# EAGLE schematic AT SoM Carrier Board V1.1 (EAGLE 9.6.1)

## Sheet 1 of 4
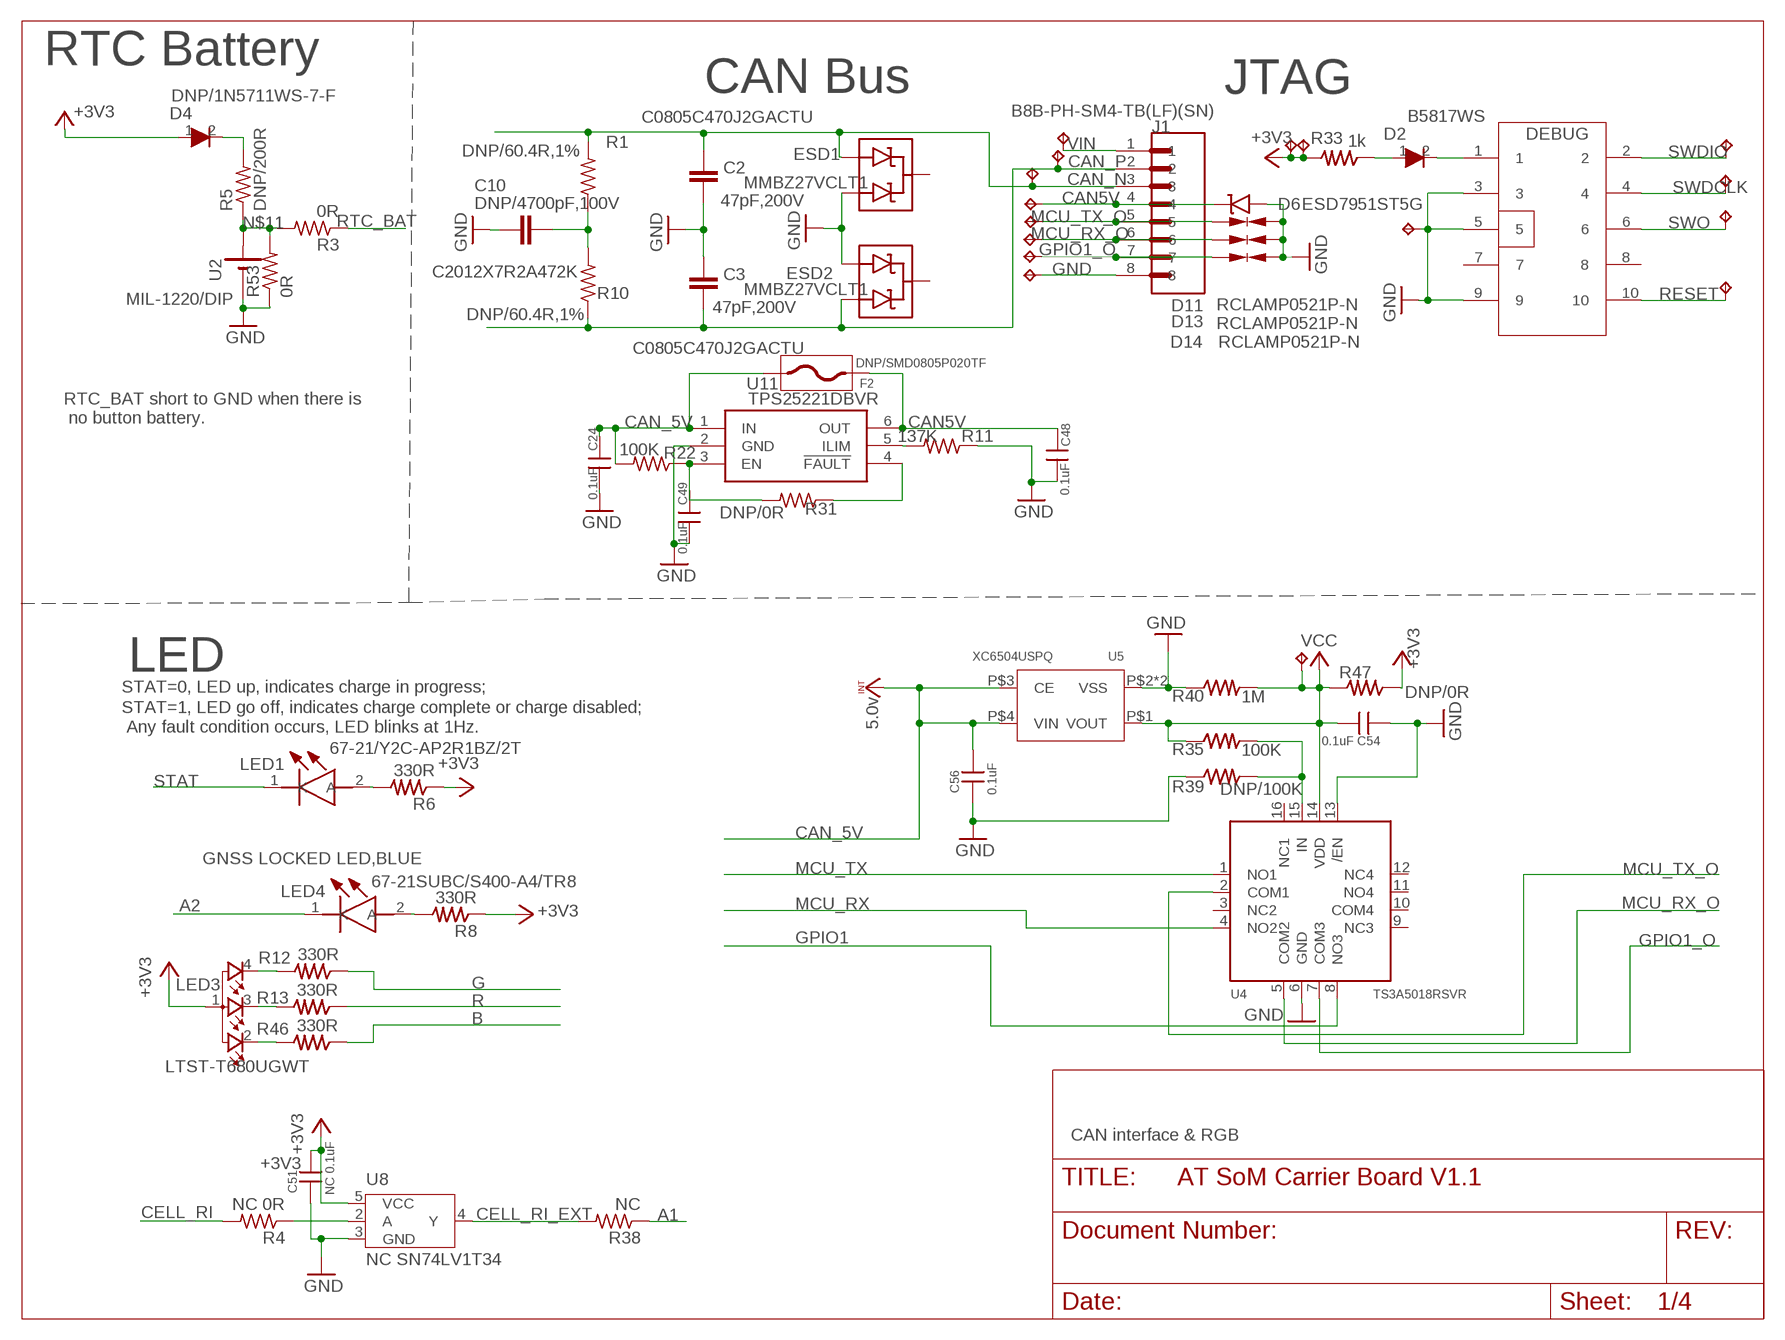
[diagram p0: schematic, sheet 1]

### Parts
C2  47pF,200V  C-EUC0805  [C0805]
C3  47pF,200V  C-EUC0805  [C0805]
C10  DNP/4700pF,100V  C-EUC0805  [C0805]
C24  0.1uF  CAP0402  [C-0402]
C48  0.1uF  CAP0402  [C-0402]
C49  0.1uF  CAP0402  [C-0402]
C51  NC 0.1uF  CAP0402  [C-0402]
C54  0.1uF  CAP0402  [C-0402]
C56  0.1uF  CAP0402  [C-0402]
D2  B5817WS  DIODESOD323  [SOD-323]
D4  DNP/1N5711WS-7-F  DIODESOD323  [SOD-323]
D6  ESD7951ST5G  ESD-TVS-UNIDIR  [0402-TVS-UNIDIR]
D11  RCLAMP0521P-N  ESD  [C0402]
D13  RCLAMP0521P-N  ESD  [C0402]
D14  RCLAMP0521P-N  ESD  [C0402]
DEBUG  CON5X2  [CON5X2_1.27]
ESD1  MMBZ27VCLT1  [SOT23-3]
ESD2  MMBZ27VCLT1  [SOT23-3]
F2  DNP/SMD0805P020TF  FUSE  [F0805]
J1  B8B-PH-SM4-TB(LF)(SN)  [JST_B8B-PH-SM4-TB(LF)(SN)]
LED1  67-21/Y2C-AP2R1BZ/2T  150141GS73113  [LEDM3528X210N]
LED3  LTST-T680UGWT  150141M173100  [150141M173100]
LED4  67-21SUBC/S400-A4/TR8  150141GS73113  [LEDM3528X210N]
R1  DNP/60.4R,1%  R-US_R1206  [R1206]
R3  0R  R-US_  [R0402_B]
R4  NC 0R  R-US_  [R0402_B]
R5  DNP/200R  R-US_  [R0402_B]
R6  330R  RES0402S  [R-0402S]
R8  330R  RES0402S  [R-0402S]
R10  DNP/60.4R,1%  R-US_R1206  [R1206]
R11  137K  R-US_  [R0402_B]
R12  330R  RES0402S  [R-0402S]
R13  330R  RES0402S  [R-0402S]
R22  100K  R-US_  [R0402_B]
R31  DNP/0R  R-US_  [R0402_B]
R33  1k  RES0402S  [R-0402S]
R35  100K  RES0402S  [R-0402S]
R38  NC  R-US_  [R0402_B]
R39  DNP/100K  RES0402S  [R-0402S]
R40  1M  RES0402S  [R-0402S]
R46  330R  RES0402S  [R-0402S]
R47  DNP/0R  RES0402S  [R-0402S]
R53  0R  R-US_  [R0402_B]
TP11  TPTP10R  [TP10R]
TP12  TPTP10R  [TP10R]
TP13  TPTP10R  [TP10R]
TP15  TPTP10R  [TP10R]
TP16  TPTP10R  [TP10R]
TP21  TPTP10R  [TP10R]
TP22  TPTP10R  [TP10R]
TP43  TPTP10R  [TP10R]
TP44  TPTP10R  [TP10R]
TP46  TPTP10R  [TP10R]
TP47  TPTP10R  [TP10R]
TP48  TPTP10R  [TP10R]
TP49  TPTP10R  [TP10R]
TP50  TPTP10R  [TP10R]
TP51  TPTP10R  [TP10R]
TP52  TPTP10R  [TP10R]
U2  MIL-1220/DIP  ML-1220/F1ANBAT_MIL-1220/DIP  [BAT_ML-1220/DIP]
U4  TS3A5018RSVR  [UQFN-16]
U5  XC6504USPQ  [USPQ-4B04]
U8  NC SN74LV1T34  SN74LV1T34  [SC70-5]
U11  TPS25221DBVR  [SOT95P280X145-6N]

### Nets
+3V3 [+3V3]: C51.1 D4.1 LED3.1 R6.1 R8.1 R33.2 R47.1 TP16.TP TP21.TP U8.5(VCC) ; also sheet 2,3
A1: R38.1 ; also sheet 2
A2: LED4.1(K) ; also sheet 2
B: R46.1 ; also sheet 2
CAN5V: C48.1 D6.1 F2.P$1 J1.4 TP48.TP U11.6(OUT)
CAN_5V: C24.1 C56.1 F2.P$2 R22.2 U5.P$3(CE) U5.P$4(VIN) U11.1(IN) ; supply symbol labelled 5.0v ; also sheet 2
CAN_N [USB_top]: C2.1 ESD1.2(A2) J1.3 R1.2 TP47.TP ; also sheet 2
CAN_P [USB_top]: C3.2 ESD2.1(A1) J1.2 R10.1 TP46.TP ; also sheet 2
CELL_RI: R4.2 ; also sheet 2
CELL_RI_EXT: R38.2 U8.4(Y)
G: R12.1 ; also sheet 2
GND: C2.2 C3.1 C10.1 C24.2 C48.2 C49.2 C51.2 C54.2 C56.2 D6.2 D11.2 D13.2 D14.2 DEBUG.3 DEBUG.5 DEBUG.9 ESD1.1(A1) ESD2.2(A2) J1.8 R11.1 R39.1 R40.1 R53.1 TP22.TP TP52.TP U2.1(N) U4.6(GND) U4.13(/EN) U5.P$2(VSS) U5.P$5(VSS) U8.3(GND) U11.2(GND) ; also sheet 2,3,4
GPIO1: U4.8(NO3) ; also sheet 2
GPIO1_O: D14.1 J1.7 TP51.TP U4.7(COM3)
MCU_RX: U4.4(NO2) ; also sheet 2
MCU_RX_O: D13.1 J1.6 TP50.TP U4.5(COM2)
MCU_TX: U4.1(NO1) ; also sheet 2
MCU_TX_O: D11.1 J1.5 TP49.TP U4.2(COM1)
N$1: LED1.2(A) R6.2
N$4: LED4.2(A) R8.2
N$6: R4.1 U8.2(A)
N$7 [3V3]: D2.2 DEBUG.1
N$9: C10.2 R1.1 R10.2
N$10: R11.2 U11.5(ILIM)
N$11: R3.2 R5.1 R53.2 U2.2(P)
N$14: C49.1 R22.1 R31.2 U11.3(EN)
N$20: LED3.4 R12.2
N$22: R31.1 U11.4(!FAULT)
N$29: D4.2 R5.2
N$30: R35.2 R39.2 U4.15(IN)
N$33: LED3.2 R46.2
N$34: LED3.3 R13.2
N$86: D2.1 R33.1
R: R13.1 ; also sheet 2
RESET: DEBUG.10 TP11.TP ; also sheet 2
RTC_BAT: R3.1 ; also sheet 2
STAT: LED1.1(K) ; also sheet 2
SWDCLK: DEBUG.4 TP13.TP ; also sheet 2
SWDIO: DEBUG.2 TP15.TP ; also sheet 2
SWO: DEBUG.6 TP12.TP ; also sheet 2
VCC: C54.1 R35.1 R40.2 R47.2 TP44.TP U4.14(VDD) U5.P$1(VOUT) ; supply symbol labelled +3v3
VIN: J1.1 TP43.TP ; also sheet 4
Unconnected: DEBUG.7 DEBUG.8 ESD1.3(C) ESD2.3(C) U4.3(NC2) U4.9(NC3) U4.10(COM4) U4.11(NO4) U4.12(NC4) U4.16(NC1)

### Notes on the sheet
- RTC Battery
- CAN Bus | JTAG
- RTC_BAT short to GND when there is
   no button battery.
- LED
- STAT=0, LED up, indicates charge in progress;
- STAT=1, LED go off, indicates charge complete or charge disabled;
- Any fault condition occurs, LED blinks at 1Hz.
- GNSS LOCKED LED,BLUE
- CAN interface & RGB

## Sheet 2 of 4
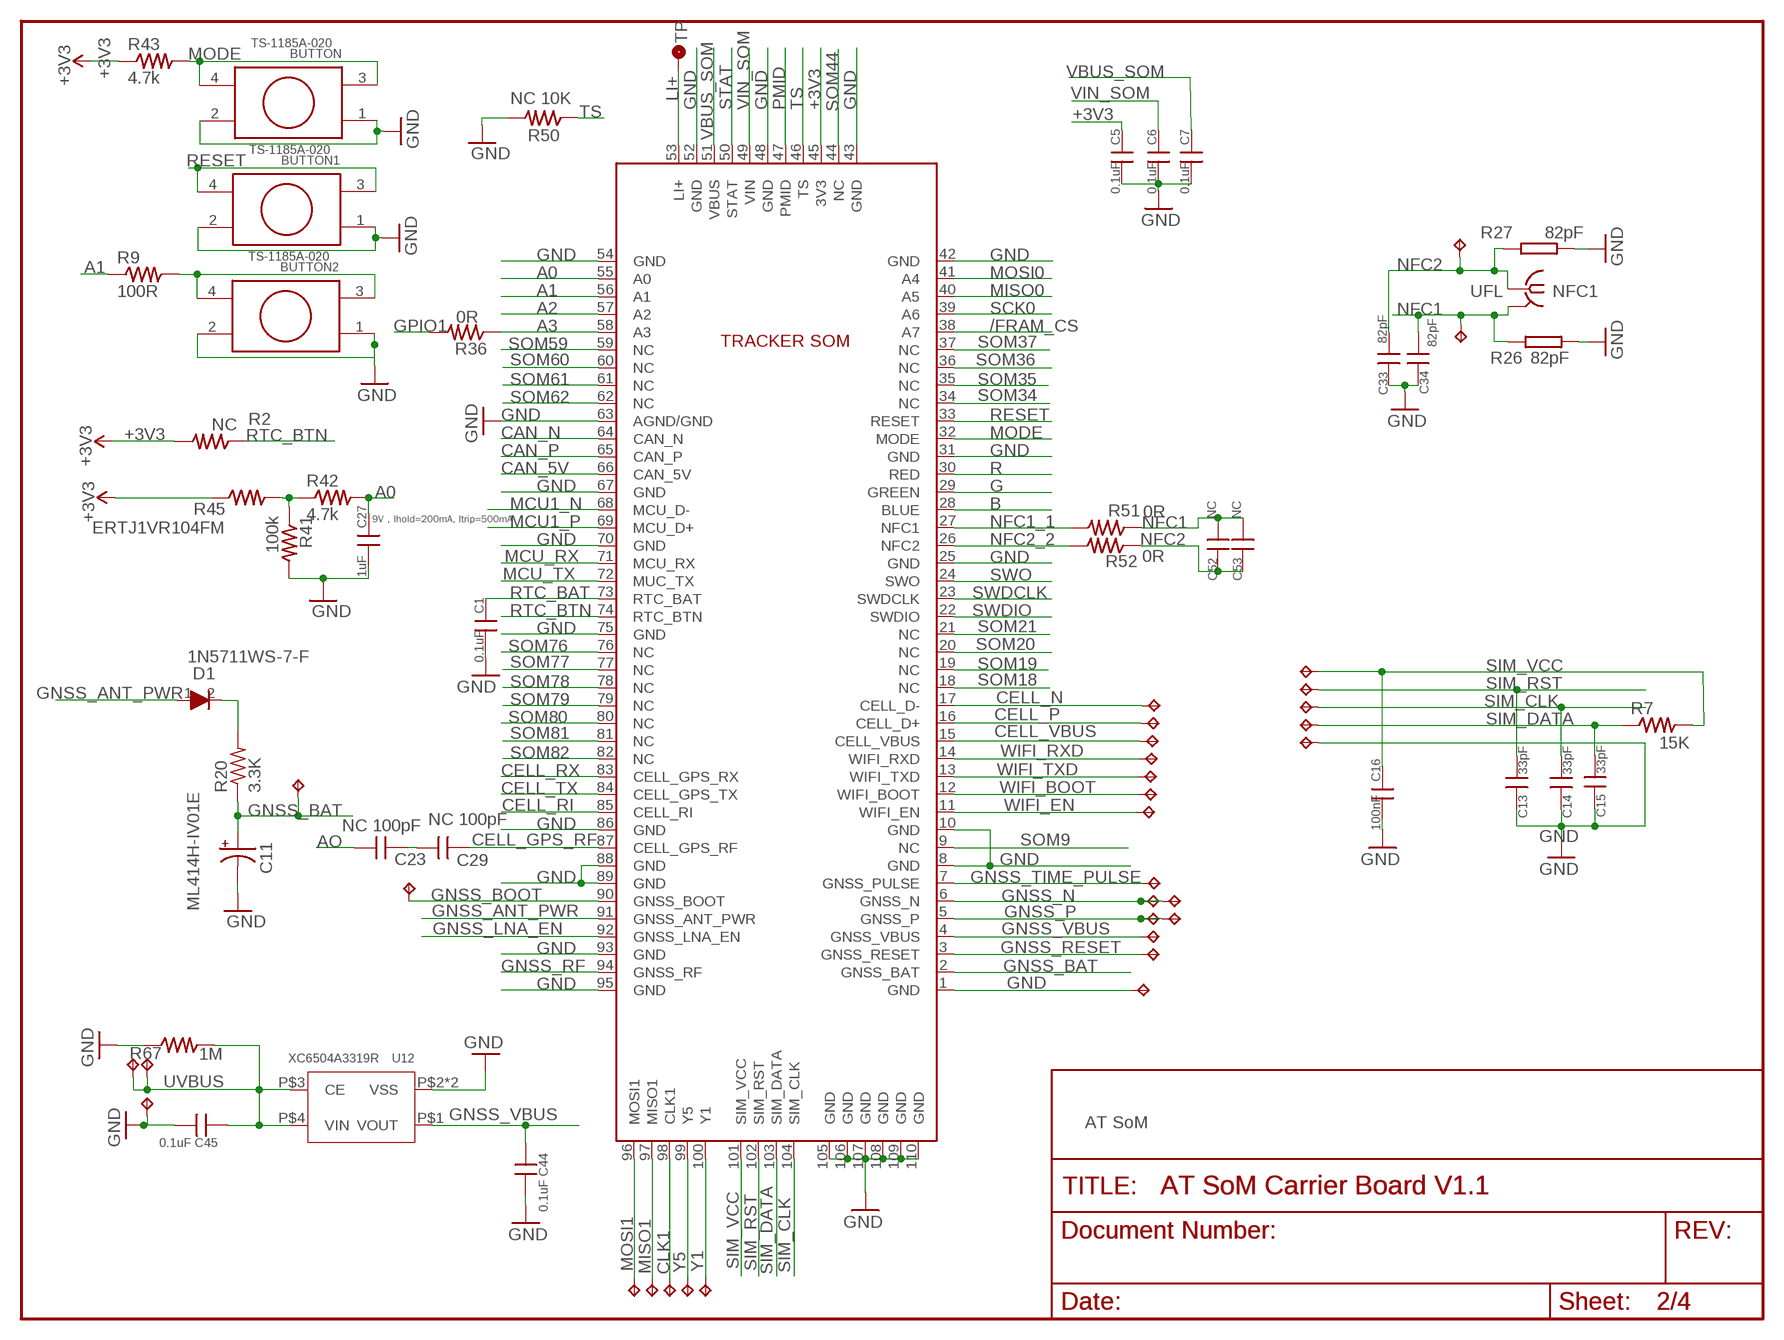
[diagram p1: schematic, sheet 2]

### Parts
BUTTON  TS-1185A-020  [TS-1185A-020]
BUTTON1  TS-1185A-020  [TS-1185A-020]
BUTTON2  TS-1185A-020  [TS-1185A-020]
C1  0.1uF  CAP0402  [C-0402]
C5  0.1uF  CAP0402  [C-0402]
C6  0.1uF  CAP0402  [C-0402]
C7  0.1uF  CAP0402  [C-0402]
C11  ML414H-IV01E  ML414HIV01E  [ML414H]
C13  33pF  CAP0402  [C-0402]
C14  33pF  CAP0402  [C-0402]
C15  33pF  CAP0402  [C-0402]
C16  100nF  CAP0402  [C-0402]
C23  NC 100pF  CAP_0402  [C0402_P]
C27  1uF  CAP0402  [C-0402]
C29  NC 100pF  CAP_0402  [C0402_P]
C33  82pF  CAP0402  [C-0402]
C34  82pF  CAP0402  [C-0402]
C44  0.1uF  CAP0402  [C-0402]
C45  0.1uF  CAP0402  [C-0402]
C52  NC  CAP0402  [C-0402]
C53  NC  CAP0402  [C-0402]
D1  1N5711WS-7-F  DIODESOD323  [SOD-323]
NFC1  UFL  IPEX-20279-001E  [IPEX-20279-001E]
R2  NC  RES0402S  [R-0402S]
R7  15K  RES0402S  [R-0402S]
R9  100R  RES0402S  [R-0402S]
R20  3.3K  RES_0603  [R0603_P]
R26  82pF  RES0402S  [R-0402S]
R27  82pF  RES0402S  [R-0402S]
R36  0R  RES0402S  [R-0402S]
R41  100k  RES0402S  [R-0402S]
R42  4.7k  RES0402S  [R-0402S]
R43  4.7k  RES0402S  [R-0402S]
R45  ERTJ1VR104FM  RESR0603  [R0603]
R50  NC 10K  RES0402S  [R-0402S]
R51  0R  RES0402S  [R-0402S]
R52  0R  RES0402S  [R-0402S]
R67  1M  RES0402S  [R-0402S]
TP1  TPTP10R  [TP10R]
TP2  TPTP10R  [TP10R]
TP3  TPTP10R  [TP10R]
TP4  TPTP10R  [TP10R]
TP5  TPTP10R  [TP10R]
TP6  TPTP10R  [TP10R]
TP7  TPTP10R  [TP10R]
TP8  TPTP10R  [TP10R]
TP9  TPTP10R  [TP10R]
TP14  TPTP10R  [TP10R]
TP17  TPTP10R  [TP10R]
TP18  TPTP10R  [TP10R]
TP19  TPTP10R  [TP10R]
TP20  TPTP10R  [TP10R]
TP27  TPTP10R  [TP10R]
TP28  TPTP10R  [TP10R]
TP29  TPTP10R  [TP10R]
TP30  TPTP10R  [TP10R]
TP31  TPTP10R  [TP10R]
TP32  TPTP10R  [TP10R]
TP33  TPTP10R  [TP10R]
TP34  TPTP10R  [TP10R]
TP35  TPTP10R  [TP10R]
TP36  TPTP10R  [TP10R]
TP37  TPTP10R  [TP10R]
TP38  TPTP10R  [TP10R]
TP39  TPTP10R  [TP10R]
TP40  TPTP10R  [TP10R]
TP41  TPTP10R  [TP10R]
TP42  TPTP10R  [TP10R]
U1  TRACKERSOM_V04  [TRACKERSOM_V04]
U12  XC6504A3319R  XC6504USPQ  [USPQ-4B04]
U$1  TP2  [TP70_BOT]
U$9  TPTP10R  [TP10R]
U$10  TPTP10R  [TP10R]

### Nets
+3V3 [+3V3]: C5.1 R2.2 R43.1 R45.1 U1.45(3V3) ; also sheet 1,3
/FRAM_CS: U1.38(A7) ; also sheet 3
A0: C27.1 R42.2 U1.55(A0)
A1: R9.1 U1.56(A1) ; also sheet 1
A2: U1.57(A2) ; also sheet 1
A3: R36.1 U1.58(A3)
AO: C23.1 ; also sheet 3
B: U1.28(BLUE) ; also sheet 1
CAN_5V: U1.66(CAN_5V) ; also sheet 1
CAN_N [USB_top]: U1.64(CAN_N) ; also sheet 1
CAN_P [USB_top]: U1.65(CAN_P) ; also sheet 1
CELL_GPS_RF: C29.2 U1.87(CELL_GPS_RF)
CELL_N [USB_top]: TP38.TP U1.17(CELL_D-)
CELL_P [USB_top]: TP36.TP U1.16(CELL_D+)
CELL_RI: U1.85(CELL_RI) ; also sheet 1
CELL_RX: U1.83(CELL_GPS_RX)
CELL_TX: U1.84(CELL_GPS_TX)
CELL_VBUS: TP35.TP U1.15(CELL_VBUS)
CLK1: TP40.TP U1.98(CLK1)
G: U1.29(GREEN) ; also sheet 1
GND: BUTTON1.1 BUTTON1.2 BUTTON2.1 BUTTON2.2 BUTTON.1 BUTTON.2 C1.2 C5.2 C6.2 C7.2 C11.- C13.1 C14.1 C15.1 C16.2 C27.2 C33.1 C34.1 C44.1 C45.1 R26.2 R27.1 R41.2 R50.2 R67.1 TP18.TP TP20.TP TP32.TP U1.1(GND) U1.8(GND) U1.10(GND) U1.25(GND) U1.31(GND) U1.42(GND) U1.43(GND) U1.48(GND) U1.52(GND) U1.54(GND) U1.63(AGND/GND) U1.67(GND) U1.70(GND) U1.75(GND) U1.86(GND) U1.88(GND) U1.89(GND) U1.93(GND) U1.95(GND) U1.105(GND) U1.106(GND) U1.107(GND) U1.108(GND) U1.109(GND) U1.110(GND) U12.P$2(VSS) U12.P$5(VSS) ; also sheet 1,3,4
GNSS_ANT_PWR: D1.1 U1.91(GNSS_ANT_PWR) ; also sheet 3
GNSS_BAT: C11.+ R20.1 TP9.TP U1.2(GNSS_BAT)
GNSS_BOOT: TP6.TP U1.90(GNSS_BOOT)
GNSS_LNA_EN: U1.92(GNSS_LNA_EN) ; also sheet 3
GNSS_N [USB_top]: TP14.TP TP34.TP U1.6(GNSS_N) ; also sheet 3
GNSS_P [USB_top]: TP5.TP TP19.TP U1.5(GNSS_P) ; also sheet 3
GNSS_RESET: TP8.TP U1.3(GNSS_RESET)
GNSS_RF: U1.94(GNSS_RF) ; also sheet 3
GNSS_TIME_PULSE: TP7.TP U1.7(GNSS_PULSE)
GNSS_VBUS: C44.2 TP30.TP U1.4(GNSS_VBUS) U12.P$1(VOUT)
GPIO1: R36.2 ; also sheet 1
LI+ [+3V3]: U1.53(LI+) U$1.P$1(TP) ; also sheet 3
MCU1_N: U1.68(MCU_D-) ; also sheet 3
MCU1_P: U1.69(MCU_D+) ; also sheet 3
MCU_RX: U1.71(MCU_RX) ; also sheet 1
MCU_TX: U1.72(MUC_TX) ; also sheet 1
MISO0: U1.40(A5) ; also sheet 3
MISO1: TP39.TP U1.97(MISO1)
MODE: BUTTON.3 BUTTON.4 R43.2 U1.32(MODE)
MOSI0: U1.41(A4) ; also sheet 3
MOSI1: TP37.TP U1.96(MOSI1)
N$2: R41.1 R42.1 R45.2
N$3: D1.2 R20.2
N$19: C23.2 C29.1
N$23: BUTTON2.3 BUTTON2.4 R9.2
NFC1: C34.2 C52.2 C53.2 NFC1.2@1(GND) NFC1.2@2(GND) R26.1 R51.1 U$10.TP
NFC1_1: R51.2 U1.27(NFC1)
NFC2: C33.2 C52.1 C53.1 NFC1.1 R27.2 R52.1 U$9.TP
NFC2_2: R52.2 U1.26(NFC2)
PMID: U1.47(PMID)
R: U1.30(RED) ; also sheet 1
RESET: BUTTON1.3 BUTTON1.4 U1.33(RESET) ; also sheet 1
RTC_BAT: C1.1 U1.73(RTC_BAT) ; also sheet 1
RTC_BTN: R2.1 U1.74(RTC_BTN)
SCK0: U1.39(A6) ; also sheet 3
SIM_CLK: C14.2 TP29.TP U1.104(SIM_CLK)
SIM_DATA: C15.2 R7.1 TP31.TP U1.103(SIM_DATA)
SIM_RST: C13.2 TP28.TP U1.102(SIM_RST)
SIM_VCC: C16.1 R7.2 TP27.TP U1.101(SIM_VCC)
SOM9: U1.9(NC)
SOM18: U1.18(NC)
SOM19: U1.19(NC)
SOM20: U1.20(NC)
SOM21: U1.21(NC)
SOM34: U1.34(NC)
SOM35: U1.35(NC)
SOM36: U1.36(NC)
SOM37: U1.37(NC)
SOM44: U1.44(NC)
SOM59: U1.59(NC)
SOM60: U1.60(NC)
SOM61: U1.61(NC)
SOM62: U1.62(NC)
SOM76: U1.76(NC)
SOM77: U1.77(NC)
SOM78: U1.78(NC)
SOM79: U1.79(NC)
SOM80: U1.80(NC)
SOM81: U1.81(NC)
SOM82: U1.82(NC)
STAT: U1.50(STAT) ; also sheet 1
SWDCLK: U1.23(SWDCLK) ; also sheet 1
SWDIO: U1.22(SWDIO) ; also sheet 1
SWO: U1.24(SWO) ; also sheet 1
TS: R50.1 U1.46(TS)
UVBUS: C45.2 R67.2 TP17.TP TP33.TP U12.P$3(CE) U12.P$4(VIN) ; also sheet 3
VBUS_SOM: C7.1 U1.51(VBUS) ; also sheet 3
VIN_SOM: C6.1 U1.49(VIN) ; also sheet 4
WIFI_BOOT: TP3.TP U1.12(WIFI_BOOT)
WIFI_EN: TP4.TP U1.11(WIFI_EN)
WIFI_RXD: TP1.TP U1.14(WIFI_RXD)
WIFI_TXD: TP2.TP U1.13(WIFI_TXD)
Y1: TP42.TP U1.100(Y1)
Y5: TP41.TP U1.99(Y5)

### Notes on the sheet
- 9V，Ihold=200mA, Itrip=500mA
- AT SoM

## Sheet 3 of 4
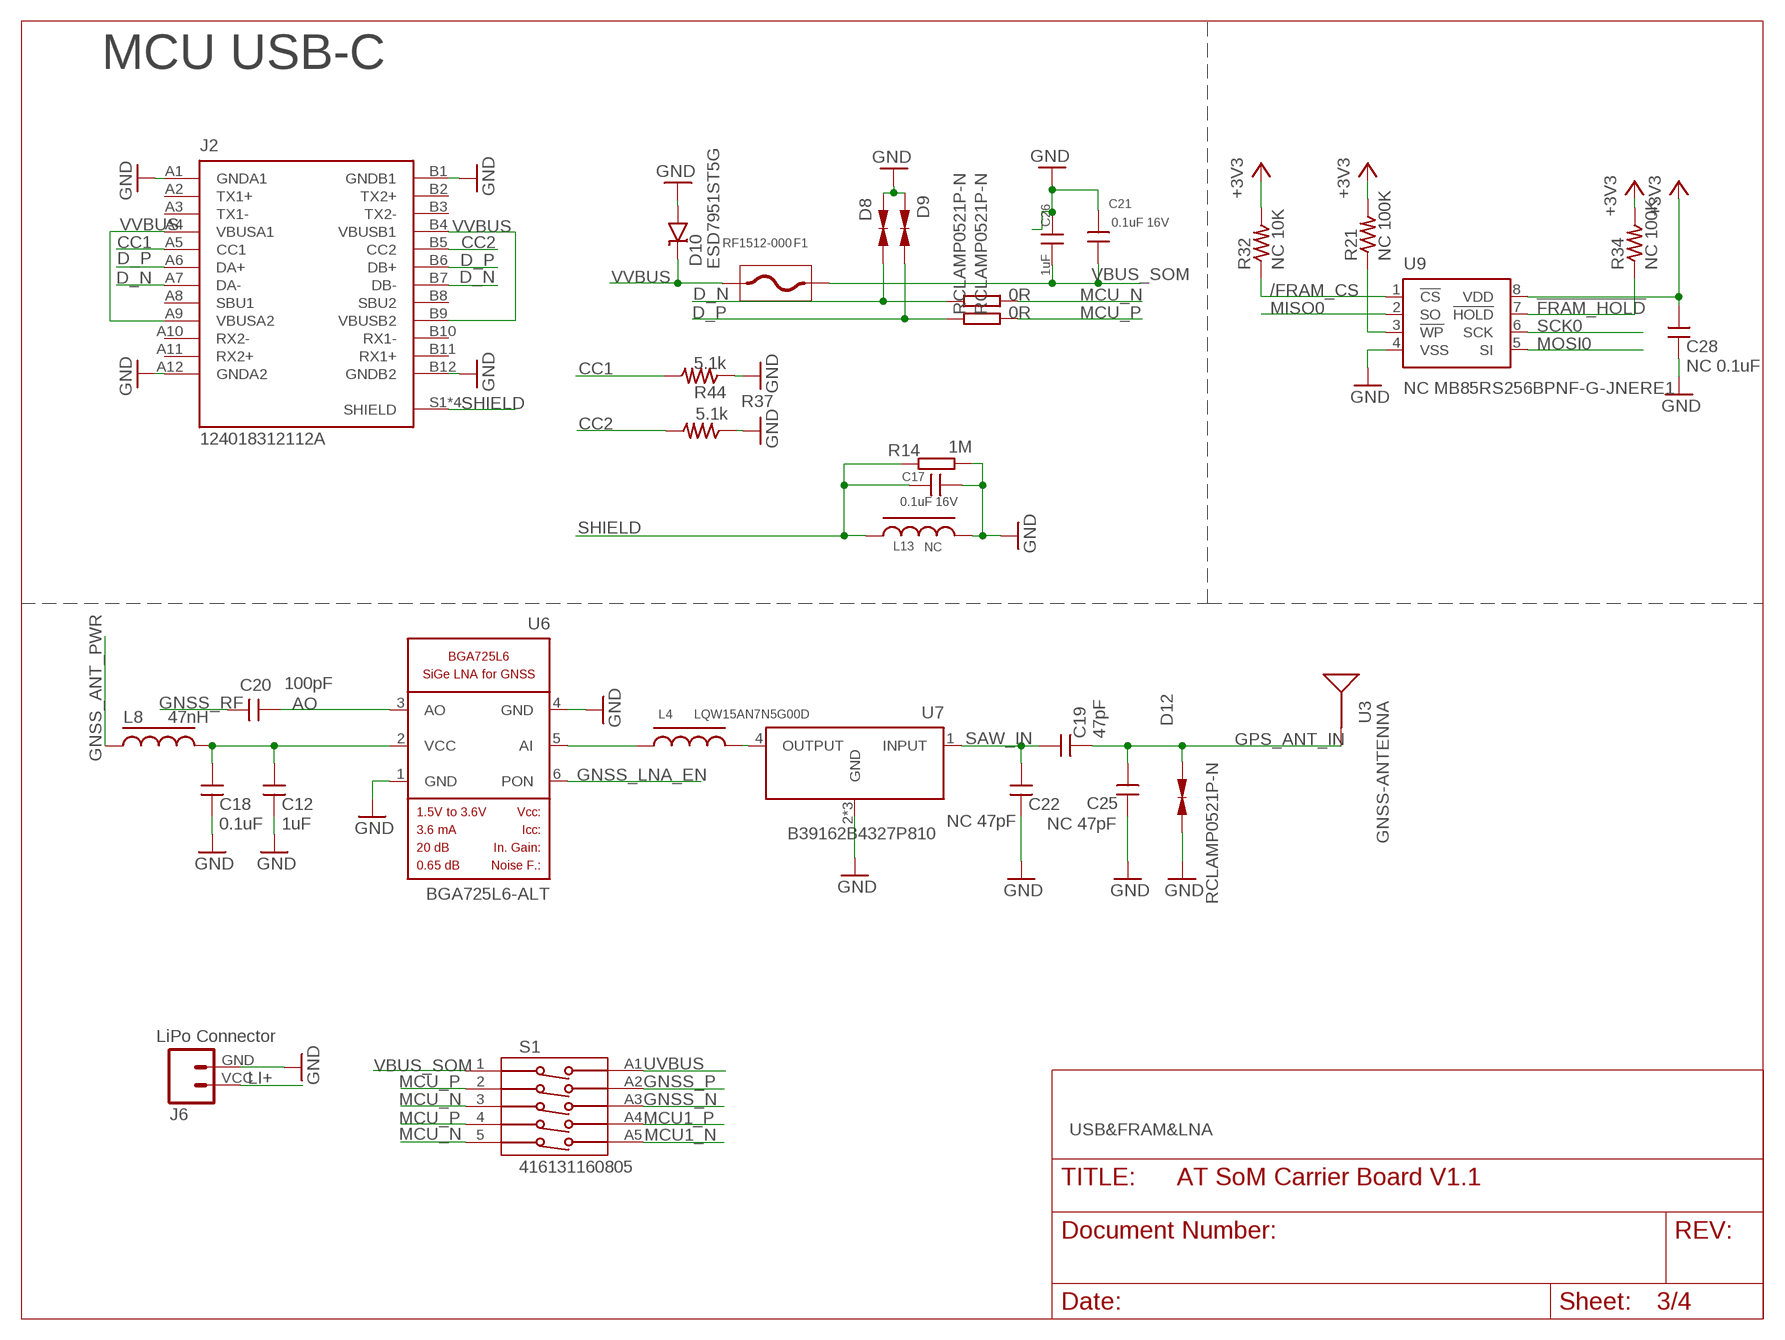
[diagram p2: schematic, sheet 3]

### Parts
C12  1uF  CAP_0402  [C0402_P]
C17  0.1uF 16V  PARTICLE-SZ_CAP0402  [PARTICLE-SZ_C-0402]
C18  0.1uF  CAP_0402  [C0402_P]
C19  47pF  CAP_0402  [C0402_P]
C20  100pF  CAP_0402  [C0402_P]
C21  0.1uF 16V  CAP0402  [C-0402]
C22  NC 47pF  CAP_0402  [C0402_P]
C25  NC 47pF  CAP_0402  [C0402_P]
C26  1uF  CAP0402  [C-0402]
C28  NC 0.1uF  CAP_0402  [C0402_P]
D8  RCLAMP0521P-N  ESD  [C0402]
D9  RCLAMP0521P-N  ESD  [C0402]
D10  ESD7951ST5G  ESD-TVS-UNIDIR  [0402-TVS-UNIDIR]
D12  RCLAMP0521P-N  ESD  [C0402]
F1  RF1512-000  FUSEF1206  [R1206]
J2  124018312112A  [AMPHENOL_124018312112A]
J6  M024UCON-15767  [JST-2-SMD-VERT]
L4  LQW15AN7N5G00D  L0402  [R-0402S]
L8  47nH  L0402  [R-0402S]
L13  NC  L  [R-0603A]
R14  1M  REDBEAR_RESR0603  [REDBEAR_R0603]
R15  0R  RES0402S  [R-0402S]
R16  0R  RES0402S  [R-0402S]
R21  NC 100K  RES0402S  [R-0402S]
R32  NC 10K  RES0402S  [R-0402S]
R34  NC 100K  RES0402S  [R-0402S]
R37  5.1k  RES0402S  [R-0402S]
R44  5.1k  RES0402S  [R-0402S]
S1  416131160805  [416131160805]
U3  GNSS-ANTENNA  [PA035AZ0004]
U6  BGA725L6-ALT  [LNA-TSLP-6-2-ALT]
U7  B39162B4327P810  FILTERS  [QCS5I]
U9  NC MB85RS256BPNF-G-JNERE1  MB85RS1MT  [SO08]

### Nets
!FRAM_HOLD: R34.1 U9.7(!HOLD)
!FRAM_WP: R21.1 U9.3(!WP)
+3V3 [+3V3]: C28.1 R21.2 R32.2 R34.2 U9.8(VDD) ; also sheet 1,2
/FRAM_CS: R32.1 U9.1(!CS) ; also sheet 2
AO: C20.2 U6.3(AO) ; also sheet 2
CC1: J2.A5(CC1) R44.2
CC2: J2.B5(CC2) R37.2
D_N [USB_top]: D8.2 J2.A7(DA-) J2.B7(DB-) R15.1
D_P [USB_top]: D9.2 J2.A6(DA+) J2.B6(DB+) R16.1
GND: C12.2 C17.2 C18.2 C21.2 C22.2 C25.1 C26.1 C28.2 D8.1 D9.1 D10.2 D12.2 J2.A1(GNDA1) J2.A12(GNDA2) J2.B1(GNDB1) J2.B12(GNDB2) J6.GND L13.2 R14.2 R37.1 R44.1 U6.1(GND) U6.4(GND) U7.2(GND) U7.3(GND) U7.5(GND) U9.4(VSS) ; also sheet 1,2,4
GNSS_ANT_PWR: L8.1 ; also sheet 2
GNSS_LNA_EN: U6.6(PON) ; also sheet 2
GNSS_N [USB_top]: S1.A3 ; also sheet 2
GNSS_P [USB_top]: S1.A2 ; also sheet 2
GNSS_RF: C20.1 ; also sheet 2
GPS_ANT_IN [RF]: C19.2 C25.2 D12.1 U3.P$1(SIGNAL)
LI+ [+3V3]: J6.VCC ; also sheet 2
MCU1_N: S1.A5 ; also sheet 2
MCU1_P: S1.A4 ; also sheet 2
MCU_N [USB_top]: R15.2 S1.3 S1.5
MCU_P [USB_top]: R16.2 S1.2 S1.4
MISO0: U9.2(SO) ; also sheet 2
MOSI0: U9.5(SI) ; also sheet 2
N$12: L4.2 U7.4(OUTPUT)
N$15: L4.1 U6.5(AI)
N$28: C12.1 C18.1 L8.2 U6.2(VCC)
SAW_IN [RF]: C19.1 C22.1 U7.1(INPUT)
SCK0: U9.6(SCK) ; also sheet 2
SHIELD: C17.1 J2.S1(SHIELD) J2.S2(SHIELD) J2.S3(SHIELD) J2.S4(SHIELD) L13.1 R14.1
UVBUS: S1.A1 ; also sheet 2
VBUS_SOM: C21.1 C26.2 F1.2 S1.1 ; also sheet 2
VVBUS: D10.1 F1.1 J2.A4(VBUSA1) J2.A9(VBUSA2) J2.B4(VBUSB1) J2.B9(VBUSB2)
Unconnected: J2.A2(TX1+) J2.A3(TX1-) J2.A8(SBU1) J2.A10(RX2-) J2.A11(RX2+) J2.B2(TX2+) J2.B3(TX2-) J2.B8(SBU2) J2.B10(RX1-) J2.B11(RX1+)

### Notes on the sheet
- MCU USB-C
- LiPo Connector
- USB&FRAM&LNA

## Sheet 4 of 4
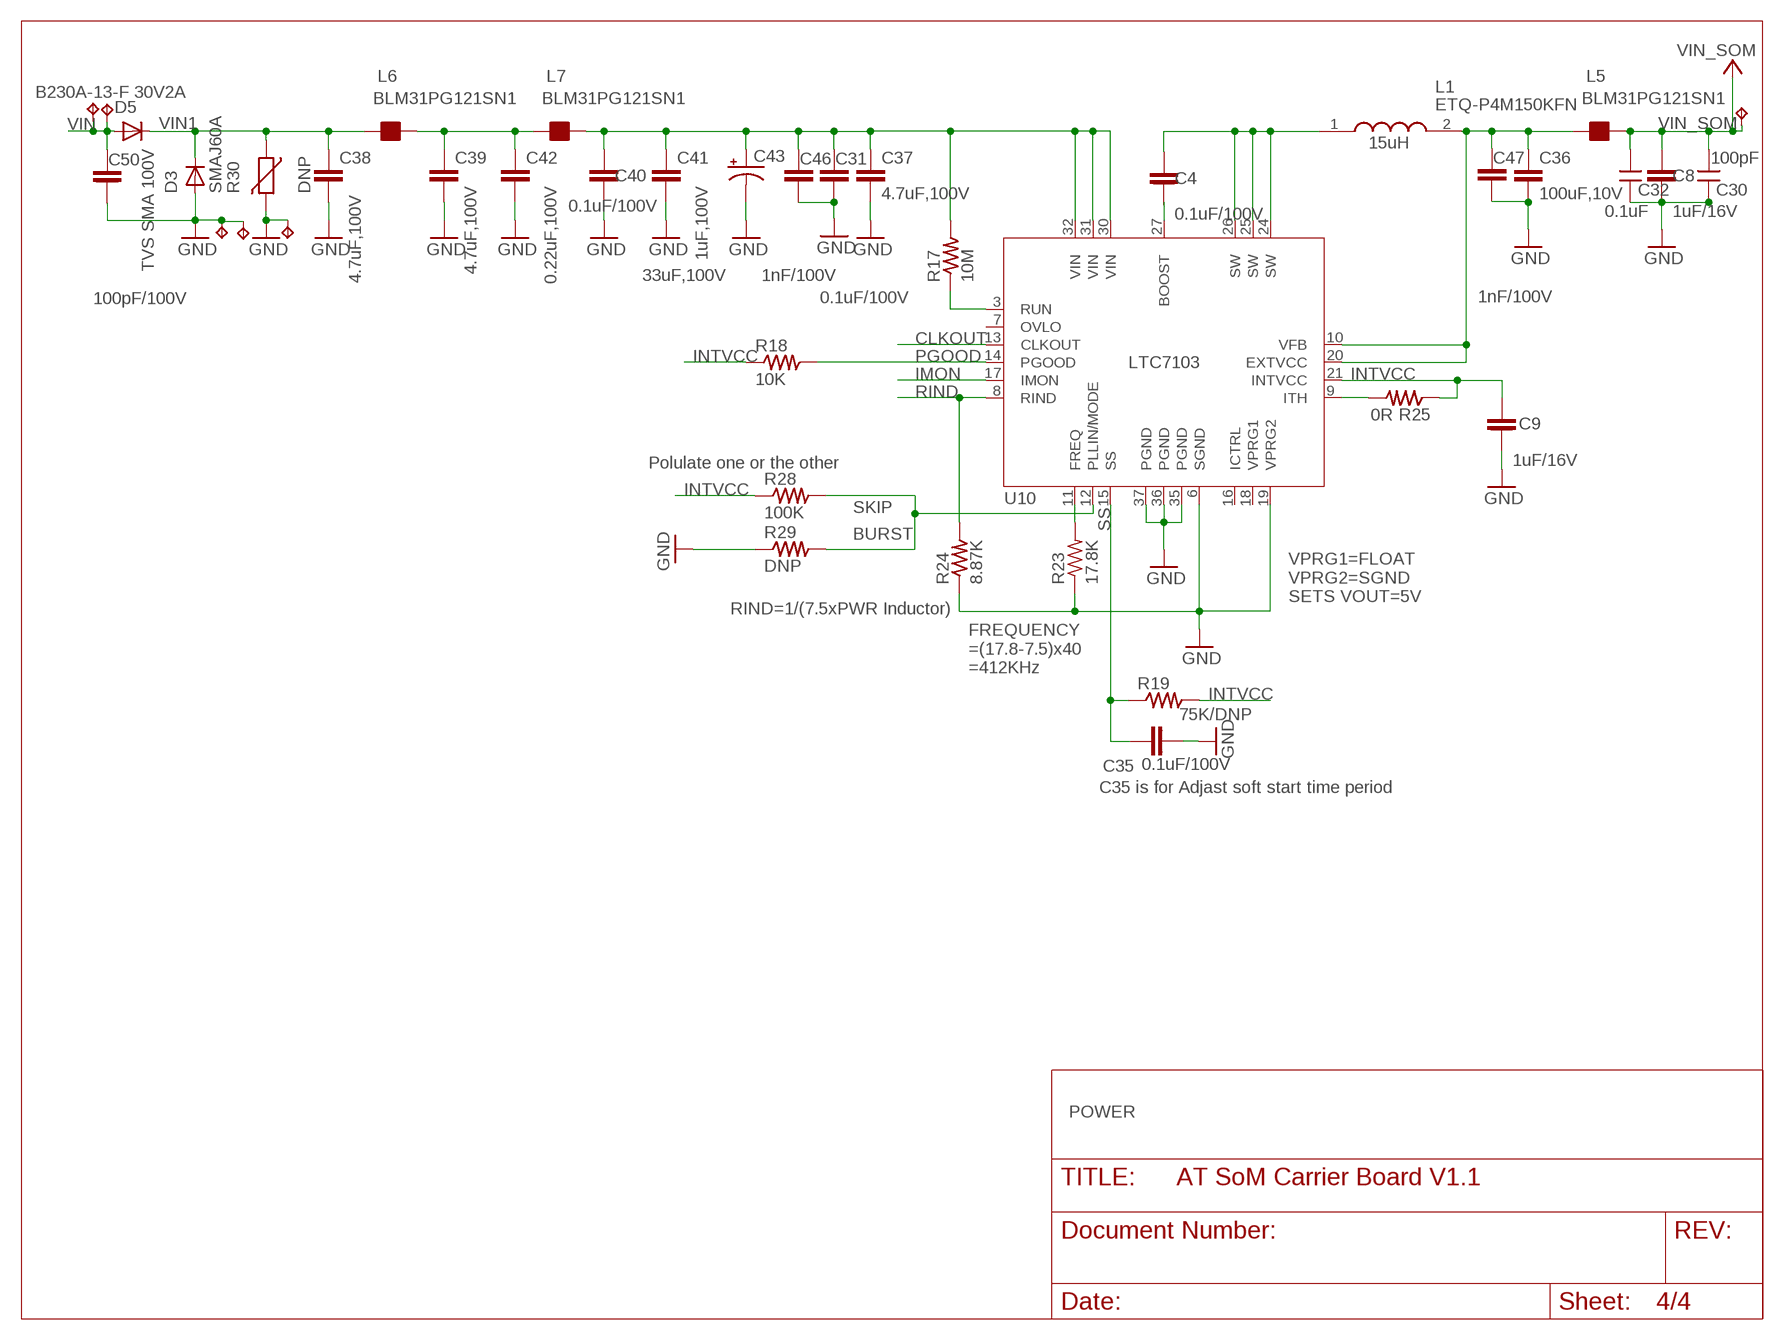
[diagram p3: schematic, sheet 4]

### Parts
C4  0.1uF/100V  CAP0603A  [C-0603A]
C8  1uF/16V  CAP0402  [C-0402]
C9  1uF/16V  CAP0402  [C-0402]
C30  100pF  CAP_0402  [C0402_P]
C31  0.1uF/100V  CAP0603A  [C-0603A]
C32  0.1uF  CAP_0402  [C0402_P]
C35  0.1uF/100V  CAP0603A  [C-0603A]
C36  100uF,10V  C-EUC1210  [C1210]
C37  4.7uF,100V  C-EUC1210  [C1210]
C38  4.7uF,100V  C-EUC1210  [C1210]
C39  4.7uF,100V  C-EUC1210  [C1210]
C40  0.1uF/100V  CAP0603A  [C-0603A]
C41  1uF,100V  C-EUC0805  [C0805]
C42  0.22uF,100V  C-EUC0805  [C0805]
C43  33uF,100V  100UF-POLAR-10X10.5-63V-20%  [NIC_10X10.5_CAP]
C46  1nF/100V  CAP0603A  [C-0603A]
C47  1nF/100V  CAP0603A  [C-0603A]
C50  100pF/100V  CAP0603A  [C-0603A]
D3  SMAJ60A  DIODESMA  [SMADIODE]
D5  B230A-13-F 30V2A  DIODESMA  [SMADIODE]
L1  ETQ-P4M150KFN  [ETQP4M150KFN]
L5  BLM31PG121SN1  FB_1206  [L1206]
L6  BLM31PG121SN1  FB_1206  [L1206]
L7  BLM31PG121SN1  FB_1206  [L1206]
R17  10M  RES0402S  [R-0402S]
R18  10K  RES0402S  [R-0402S]
R19  75K/DNP  RES0402S  [R-0402S]
R23  17.8K  RES_0603  [R0603_P]
R24  8.87K  RES0402S  [R-0402S]
R25  0R  RES0402S  [R-0402S]
R28  100K  RES0402S  [R-0402S]
R29  DNP  RES0402S  [R-0402S]
R30  DNP  VARISTOR-2,5  [R-5]
TP10  TPTP10R  [TP10R]
TP23  TPTP10R  [TP10R]
TP24  TPTP10R  [TP10R]
TP25  TPTP10R  [TP10R]
TP26  TPTP10R  [TP10R]
TP45  TPTP10R  [TP10R]
U10  LTC7103  [UHE36(26)QFN]

### Nets
CLKOUT: U10.13(CLKOUT)
GND: C8.2 C9.2 C30.2 C31.2 C32.2 C35.2 C36.2 C37.2 C38.2 C39.2 C40.2 C41.2 C42.2 C43.- C46.2 C47.2 C50.2 D3.A R23.1 R24.1 R29.1 R30.2 TP24.TP TP25.TP TP26.TP U10.6(SGND) U10.19(VPRG2) U10.35(PGND) U10.36(PGND) U10.37(PGND) ; also sheet 1,2,3
IMON: U10.17(IMON)
INTVCC: C9.1 R18.1 R19.2 R25.1 R28.1 U10.21(INTVCC)
N$13: C4.2 U10.27(BOOST)
N$16: C36.1 C47.1 L1.2 L5.1 U10.10(VFB) U10.20(EXTVCC)
N$17: C4.1 L1.1 U10.24(SW) U10.25(SW) U10.26(SW)
N$18: C39.1 C42.1 L6.2 L7.1
N$21: R17.1 U10.3(RUN)
N$24: R23.2 U10.11(FREQ)
N$25: R28.2 R29.2 U10.12(PLLIN/MODE)
N$26: R25.2 U10.9(ITH)
N$27: C31.1 C37.1 C40.1 C41.1 C43.+ C46.1 L7.2 R17.2 U10.30(VIN) U10.31(VIN) U10.32(VIN)
PGOOD: R18.2 U10.14(PGOOD)
RIND: R24.2 U10.8(RIND)
SS: C35.1 R19.1 U10.15(SS)
VIN: C50.1 D5.A TP23.TP TP45.TP ; also sheet 1
VIN1: C38.1 D3.C D5.C L6.1 R30.1
VIN_SOM: C8.1 C30.1 C32.1 L5.2 TP10.TP ; also sheet 2
Unconnected: U10.7(OVLO) U10.16(ICTRL) U10.18(VPRG1)

### Notes on the sheet
- TVS SMA 100V | 15uH
- Polulate one or the other
- SKIP
- BURST
- RIND=1/(7.5xPWR Inductor)
- VPRG1=FLOAT
  VPRG2=SGND
  SETS VOUT=5V
- FREQUENCY
  =(17.8-7.5)x40
  =412KHz
- C35 is for Adjast soft start time period
- POWER

## Library data of the parts
BUTTON BUTTON1 BUTTON2 = RedBear DUO:TS-1185A-020
C1 C5-C7 C13-C16 C21 C24 C26 C27 C33 C34 C44 C45 C48 C49 C51-C54 C56 = RedBear:CAP: CAP
C2 C3 = rcl:C-EU: CAPACITOR, European symbol; PART_NUMBER: C0805C470J2GACTU; SPICEPREFIX: C
C4 C8 C9 C31 C35 C40 C46 C47 C50 = PATI M.2 daughter board V001:CAP: CAP
C10 = rcl:C-EU: CAPACITOR, European symbol; PART_NUMBER: C2012X7R2A472K; SPICEPREFIX: C
C11 = particle-internal:ML414HIV01E
C12 C18-C20 C22 C23 C25 C28-C30 C32 = particle-studios:CAP_
C17 = Asset Tracker SoM v0.01:PARTICLE-SZ_CAP: CAP
C36-C39 C41 C42 = rcl:C-EU: CAPACITOR, European symbol; SPICEPREFIX: C
C43 = SparkFun-Capacitors:100UF-POLAR: 100µF polarized capacitors A capacitor is a passive two-terminal electrical component used to store electrical energy temporarily in an electric field.; PROD_ID: CAP-08362; VALUE: 100uF
D1 D2 D4 = particle SZ:DIODE: DIODE
D3 D5 = particle-studios:DIODE: Diode SMADIODE - SMA Surface Mount Package 20V 1A Schottky Diode Digikey: 641-1014-6-ND DO-1N4148 - Through Hole Small Current Diode SOD-123 20V 1 A (.5mV Vf) Schottky Diode - Digikey: MBRX120TPMSCT-ND SOD-323 10V 570mA (.38mV Vf, 3ns) Schottky Diode - Digikey: ZLLS410CT-ND SOD-523 30V 30mA Schottky Diode (RB751S-40TE61) - Digikey: RB751S-40TE61CT-ND SOT23-R/W - SOT23 Package (R = Solder Paste/Reflow Ovens, W = Hand-Soldering) BAT54Film 40V 300mA - Digikey: 497-7162-1-ND
D6 D10 = Particle:ESD-TVS-UNIDIR: Cree® XLamp® XP-E LEDs Source: www.cree.com/xlamp .. XLampXP-E.pdf
D8 D9 D11-D14 = particle SZ:ESD
DEBUG = RedBear:CON5X2
ESD1 ESD2 = SparkFun:MMBZ27VCLT1
F1 F2 = RedBear:FUSE
J1 = B6B-PH-SM4-TB_LF__SN_:B8B-PH-SM4-TB(LF)(SN): PH Series 2 mm Pitch 12 Position SMT Single Row Top Entry Shrouded Header
J2 = 124018312112A:124018312112A: USB-C (USB TYPE-C) USB 3.0 (USB 3.1 Gen 1, Superspeed) Receptacle Connector 24 Position Board Edge, Cutout; Surface Mount; Through Hole, Right Angle; AVAILABILITY: Unavailable; DESCRIPTION: USB-C _USB TYPE-C_ USB 3.0 _USB 3.1 Gen 1, Superspeed_ Receptacle Connector 24 Position Board Edge, Cutout; Surface Mount; Through Hole, Right Angle; MF: Amphenol ICC; MP: 124018312112A; PACKAGE: None; PRICE: None
J6 = SparkFun-Connectors:M02: Standard 2-pin 0.1" header. Use with - straight break away headers ( PRT-00116) - right angle break away headers (PRT-00553) - swiss pins (PRT-00743) - machine pins (PRT-00117) - female headers (PRT-00115) Molex polarized connector foot print use with: PRT-08233 with associated crimp pins and housings. 2.54_SCREWTERM for use with PRT-10571. 3.5mm Screw Terminal footprints for PRT-08084 5mm Screw Terminal footprints for use with PRT-08432
L1 = SamacSys_Parts:ETQ-P4M150KFN: 15H Shielded Inductor 4.2A 70.18mOhm Max Nonstandard Source: Datasheet <https://industrial.panasonic.com/cdbs/www-data/pdf/AGL0000/AGL0000C59.pdf>; DESCRIPTION: 15H Shielded Inductor 4.2A 70.18mOhm Max Nonstandard; HEIGHT: 4.8mm; MANUFACTURER_NAME: Panasonic; MANUFACTURER_PART_NUMBER: ETQ-P4M150KFN
L4 L13 = RedBear:L
L5-L7 = rc-master:FB_: FERRITE BEAD
L8 = particle SZ:L
LED1 LED4 = 150141GS73113:150141GS73113: vv Source: Datasheet <https://katalog.we-online.de/led/datasheet/150141GS73113.pdf>; DESCRIPTION: vv; HEIGHT: 2.1mm; MANUFACTURER_NAME: Wurth Elektronik; MANUFACTURER_PART_NUMBER: 150141GS73113; MOUSER_PART_NUMBER: 710-150141GS73113; MOUSER_PRICE-STOCK: https://www.mouser.com/Search/Refine.aspx?Keyword=710-150141GS73113; RS_PART_NUMBER: 1847238P; RS_PRICE-STOCK: http://uk.rs-online.com/web/p/products/1847238P
LED3 = RGB:150141M173100: LED,Wurth Elektronik,150141M173100 Wurth Elektronik 150141M173100, WL-SFTW Series 3 RGB LED, 470 / 520 / 625 nm 4-Pin 3528 (1411), Round Lens SMD package Source: Datasheet <https://componentsearchengine.com/Datasheets/1/150141M173100.pdf>
NFC1 = Particle:IPEX-20279-001E: Ultra Miniature Coaxial SMT RF Receptacle
R1 R10 = rcl:R-US_: RESISTOR, American symbol; SPICEPREFIX: R
R2 R6-R9 R12 R13 R33 R41-R43 R46 R47 = particle SZ:RES: RES
R3-R5 R11 R22 R31 R38 R53 = Particle:R-US_: 0402 Resistor
R14 = Asset Tracker SoM v0.01:REDBEAR_RES: RES
R15 R16 R26 R27 = RedBear:RES: RES
R17-R19 R21 R24 R25 R28 R29 R32 R34-R37 R39 R40 R44 R45 R50-R52 R67 = AT SoM Carrier Board V0.1:RES: RES
R20 R23 = particle-studios:RES_
R30 = varistor:VARISTOR: VARISTOR
S1 = 416131160805:416131160805: WS-DISV 1.27mm small compact SMD flat actuator with top tape Specification MATERIAL PROPERTIES: Cover Material PPA Cover Flammability Rating UL94 V-0 Cover Color Brown Base Material PPA Base Flammability Rating UL94 V-0 Base Color Brown Actuator Material PA46 Actuator Flammability Rating UL94 V-0 Actuator Color White Contact Plating Gold Terminal Plating Gold ELECTRICAL PROPERTIES: Rated Current Switching 25 mA Rated Current Non-Switching 100 mA Contact Resistance Initial 100 mΩ Contact Resistance After Life Test 200 mΩ Insulation Resistance 100 MΩ Withstanding Voltage 300 V (AC) MECHANICAL PROPERTIES: Operation Force 500 g Electrical Life 1000 Cycles Mechanical Life min. 2000 cycles Actuator Type Flat Type Switch Position Off <http://katalog.we-online.de/media/images/v2/Family_WS-DISV_SMD_FLAT_ACTUATOR_4161311608xx_4C.jpg> Details see: http://katalog.we-online.de/en/em/DISV_1_27_SMALL_COMPACT_SMD_FLAT_ACTUATOR/416131160805 2017 (C) Wurth Elektronik; AVAILABILITY: Unavailable; DESCRIPTION: Dip Switch SPST 5 Position Surface Mount Slide _Standard_ Actuator 25mA 24VDC; MF: Wurth Electronics; MP: 416131160805; PACKAGE: None; PRICE: None
TP1-TP52 U$9 U$10 = testpad:TP: Test pad
U1 = AT SoM Carrier Board V1.1:TRACKERSOM_V04: Particle E0
U2 = AT SoM Carrier Board V0.2:ML-1220/F1AN: Battery; Coin Cell; Lithium; Rechargeable; PCB Tabs; 3V; 17 mAh
U3 = Particle:GNSS-ANTENNA: http://www.cirocomm.com/en-global/products_ciro/detail/PA035AZ0004 GPS-Glonass-Beidou Patch Pin Type 35*35*3mm PA035AZ0004 GPS+Glonass+Beidou Patch antenna
U4 = particle SZ:TS3A5018RSVR
U5 U12 = particle SZ:XC6504
U6 = Particle:BGA725L6
U7 = Particle:FILTERS
U8 = Particle:SN74LV1T34: Texas Instruments Single Power Supply Single Buffer GATE CMOS Logic Level Shifter
U9 = RGB:MB85RS1MT
U10 = particle-studios:LTC7103: Analog Devices 105V, 2.3A Low EMI Synchronous Step-Down Regulator
U11 = TPS2522 :TPS25221DBVR: Precision Adjustable Current-Limited Power-Distribution Switches Source: Datasheet <http://www.ti.com/lit/gpn/tps25221>; ARROW_PART_NUMBER: TPS25221DBVR; ARROW_PRICE-STOCK: https://www.arrow.com/en/products/tps25221dbvr/texas-instruments; DESCRIPTION: Precision Adjustable Current-Limited Power-Distribution Switches; HEIGHT: 1.45mm; MANUFACTURER_NAME: Texas Instruments; MANUFACTURER_PART_NUMBER: TPS25221DBVR; MOUSER_PART_NUMBER: 595-TPS25221DBVR; MOUSER_PRICE-STOCK: https://www.mouser.co.uk/ProductDetail/Texas-Instruments/TPS25221DBVR?qs=MLItCLRbWsxfIIG64r6YKw%3D%3D
U$1 = Particle:TP: Test Points of all sizes and shapes

## Net classes
2 RF: width 0.293 mm, clearance 0.257 mm
3 usb_lay3: width 0.279 mm, clearance 0.203 mm
4 3V3: width 0.305 mm, clearance 0.508 mm
5 USB_top: width 0.279 mm, drill 0.254 mm, clearance 0.203 mm
6 +3V3: width 0.203 mm, clearance 0.152 mm
7 PMID: width 0.305 mm, clearance 0.508 mm
8 CAN: width 0.152 mm, clearance 0.267 mm